# Altium project interface_board_1u.PrjPcb
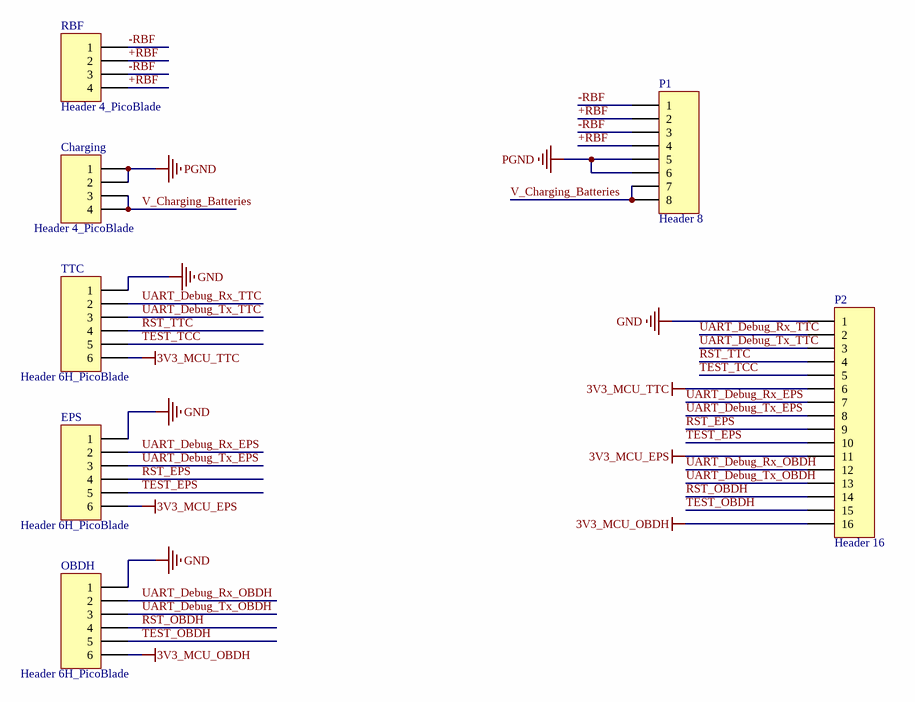
[diagram p0: connectors.SchDoc]
1 sheet, 7 parts. Net scope: global (net labels, ports and power ports of the same name join across sheets).
Board file: interface_board_1u.PcbDoc

## Sheet connectors.SchDoc: Connectors
size A4; DrawnBy: Sara V. Martínez; Engineer: Flight; Revision: v0.1; SheetNumber: 1; SheetTotal: 1; ProjectCode: interface

### Parts
Charging  Header 4_PicoBlade  [HDR4 PicoBlade]
EPS  Header 6H_PicoBlade  [HDR6 PicoBlade]
OBDH  Header 6H_PicoBlade  [HDR6 PicoBlade]
P1  Header 8  [HDR1X8]
P2  Header 16  [HDR1X16]
RBF  Header 4_PicoBlade  [HDR4 PicoBlade]
TTC  Header 6H_PicoBlade  [HDR6 PicoBlade]

### Nets
3V3_MCU_EPS: EPS.6 P2.11
3V3_MCU_OBDH: OBDH.6 P2.16
3V3_MCU_TTC: P2.6 TTC.6
GND: EPS.1 OBDH.1 P2.1 TTC.1
PGND: Charging.1 Charging.2 P1.5 P1.6
+RBF: P1.2 P1.4 RBF.2 RBF.4
-RBF: P1.1 P1.3 RBF.1 RBF.3
RST_EPS: EPS.4 P2.9
RST_OBDH: OBDH.4 P2.14
RST_TTC: P2.4 TTC.4
TEST_EPS: EPS.5 P2.10
TEST_OBDH: OBDH.5 P2.15
TEST_TCC: P2.5 TTC.5
UART_Debug_Rx_EPS: EPS.2 P2.7
UART_Debug_Rx_OBDH: OBDH.2 P2.12
UART_Debug_Rx_TTC: P2.2 TTC.2
UART_Debug_Tx_EPS: EPS.3 P2.8
UART_Debug_Tx_OBDH: OBDH.3 P2.13
UART_Debug_Tx_TTC: P2.3 TTC.3
V_Charging_Batteries: Charging.3 Charging.4 P1.7 P1.8

### Notes on the sheet
- Project:
- SpaceLab - Federal University of Santa Catarina
- Title:
- Designed by:
- Project Code:
- Date:
- Revision:
- Sheet
- of
- Size:
- A4

### Library data of the parts
Charging RBF = Header 4_PicoBlade: Header, 4-Pin; PartNumber: 53398-0471; LatestRevisionDate: 17-Jul-2002; LatestRevisionNote: Re-released for DXP Platform.; Publisher: Altium Limited
EPS OBDH TTC = Header 6H_PicoBlade: Header, 6-Pin, Right Angle; Partnumber: 53398-0671; LatestRevisionDate: 17-Jul-2002; LatestRevisionNote: Re-released for DXP Platform.; Publisher: Altium Limited
P1 = Header 8: Header, 8-Pin; LatestRevisionDate: 17-Jul-2002; LatestRevisionNote: Re-released for DXP Platform.; Publisher: Altium Limited
P2 = Header 16: Header, 16-Pin; LatestRevisionDate: 17-Jul-2002; LatestRevisionNote: Re-released for DXP Platform.; Publisher: Altium Limited